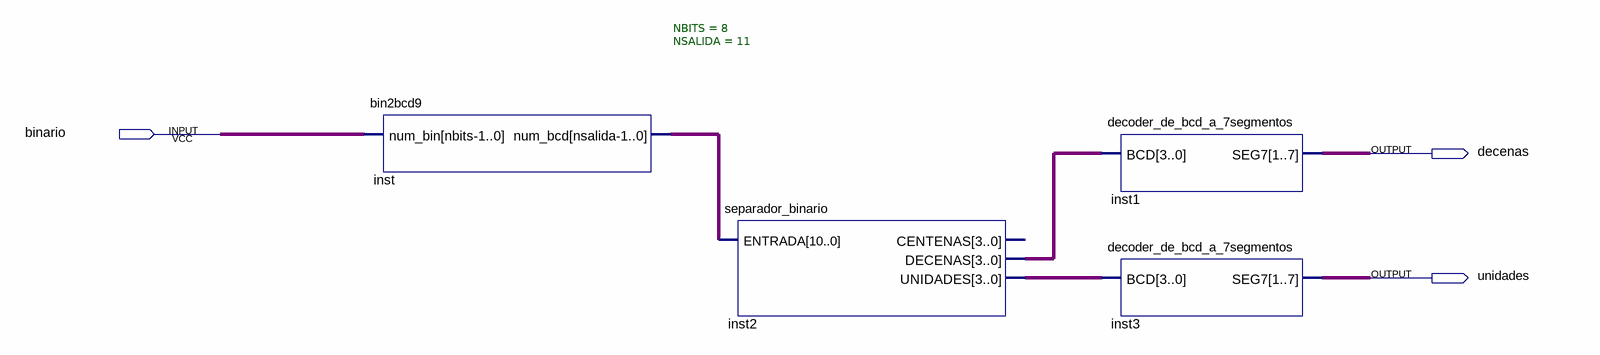
[diagram p0: schematic sheet]
// Quartus schematic convertidor prueba.bdf as structural Verilog: 4 symbols, 3 pins
module \convertidor_prueba  (
  input  binario,
  output decenas,
  output unidades
);

  wire [3:0] inst2_decenas, inst2_unidades;
  wire [6:0] inst1_seg7, inst3_seg7;
  wire [7:0] undriven;
  wire [10:0] inst_num_bcd;

  bin2bcd9 #(.NBITS(8), .NSALIDA(11)) inst (.num_bin(undriven), .num_bcd(inst_num_bcd));
  separador_binario inst2 (
    .ENTRADA(inst_num_bcd), .DECENAS(inst2_decenas), .UNIDADES(inst2_unidades));  // open: CENTENAS
  decoder_de_bcd_a_7segmentos inst1 (.BCD(inst2_decenas), .SEG7(inst1_seg7));
  decoder_de_bcd_a_7segmentos inst3 (.BCD(inst2_unidades), .SEG7(inst3_seg7));
endmodule
